# Altium schematic sheet CH340C9R-R1.SchDoc
size 228 x 152 mm; SheetNumber: 0; SheetTotal: 0
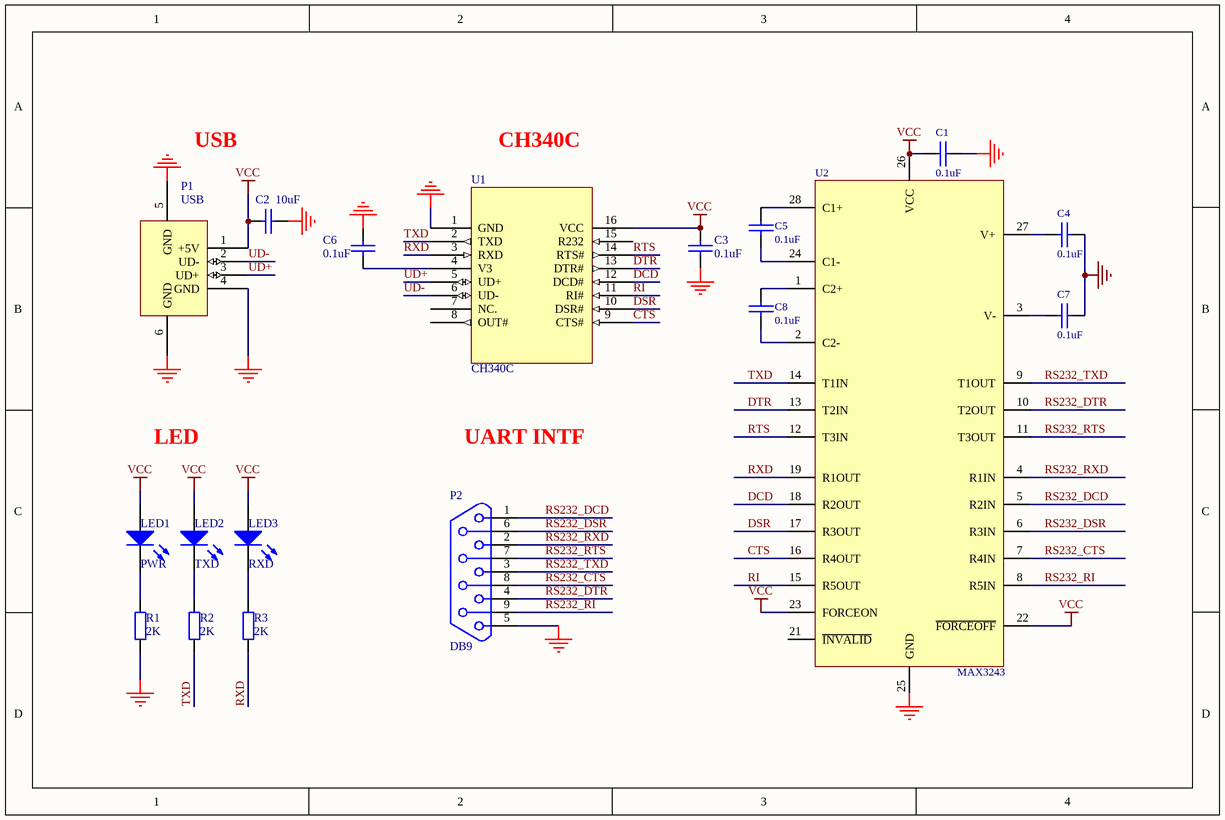
[diagram p0: CH340C9R-R1.SchDoc]

## Parts
C1  0.1uF  [0603_C]
C2  10uF  [3216_C]
C3  0.1uF  [0603_C]
C4  0.1uF  [0603_C]
C5  0.1uF  [0603_C]
C6  0.1uF  [0603_C]
C7  0.1uF  [0603_C]
C8  0.1uF  [0603_C]
LED1  PWR  [0603+]
LED2  TXD  [0603+]
LED3  RXD  [0603+]
P1  USB  [USBAM]
P2  DB9  [DB9-PAD-M]
R1  2K  [0603]
R2  2K  [0603]
R3  2K  [0603]
U1  CH340C  [SOP16]
U2  MAX3243  [SSOP28]

## Nets
GND: C1.2 C2.2 C3.2 C4.2 C6.2 C7.2 P1.4(GND) P1.5(GND) P1.6(GND) P2.5 R1.2 U1.1(GND) U2.25(GND)
VCC: C1.1 C2.1 C3.1 LED1.1(A) LED2.1(A) LED3.1(A) P1.1(+5V) U1.16(VCC) U2.22(~{FORCEOFF}) U2.23(FORCEON) U2.26(VCC)
CTS: U1.9(CTS#) U2.16(R4OUT)
DCD: U1.12(DCD#) U2.18(R2OUT)
DSR: U1.10(DSR#) U2.17(R3OUT)
DTR: U1.13(DTR#) U2.13(T2IN)
RI: U1.11(RI#) U2.15(R5OUT)
RS232_CTS: P2.8 U2.7(R4IN)
RS232_DCD: P2.1 U2.5(R2IN)
RS232_DSR: P2.6 U2.6(R3IN)
RS232_DTR: P2.4 U2.10(T2OUT)
RS232_RI: P2.9 U2.8(R5IN)
RS232_RTS: P2.7 U2.11(T3OUT)
RS232_RXD: P2.2 U2.4(R1IN)
RS232_TXD: P2.3 U2.9(T1OUT)
RTS: U1.14(RTS#) U2.12(T3IN)
RXD: R3.2 U1.3(RXD) U2.19(R1OUT)
TXD: R2.2 U1.2(TXD) U2.14(T1IN)
UD+: P1.3(UD+) U1.5(UD+)
UD-: P1.2(UD-) U1.6(UD-)
NetC4_1: C4.1 U2.27(V+)
NetC5_1: C5.1 U2.28(C1+)
NetC5_2: C5.2 U2.24(C1-)
NetC6_1: C6.1 U1.4(V3)
NetC7_1: C7.1 U2.3(V-)
NetC8_1: C8.1 U2.1(C2+)
NetC8_2: C8.2 U2.2(C2-)
NetLED1_2: LED1.2(K) R1.1
NetLED2_2: LED2.2(K) R2.1
NetLED3_2: LED3.2(K) R3.1

Not connected (* = marked no-connect by the designer): U1 7(NC.) 8(OUT#) 15(R232); U2 21(~{INVALID})

## Notes on the sheet
- USB
- CH340C
- LED
- UART INTF

## Library data of the parts
C1 C4 C5 C7 C8 = CAP
C2 C3 C6 = CAP: Capacitor
LED1-LED3 = LED2: Typical RED, GREEN, YELLOW, AMBER GaAs LED
R1-R3 = Res2: Resistor
U1 = CH340C: USB to TTL Serial / UART